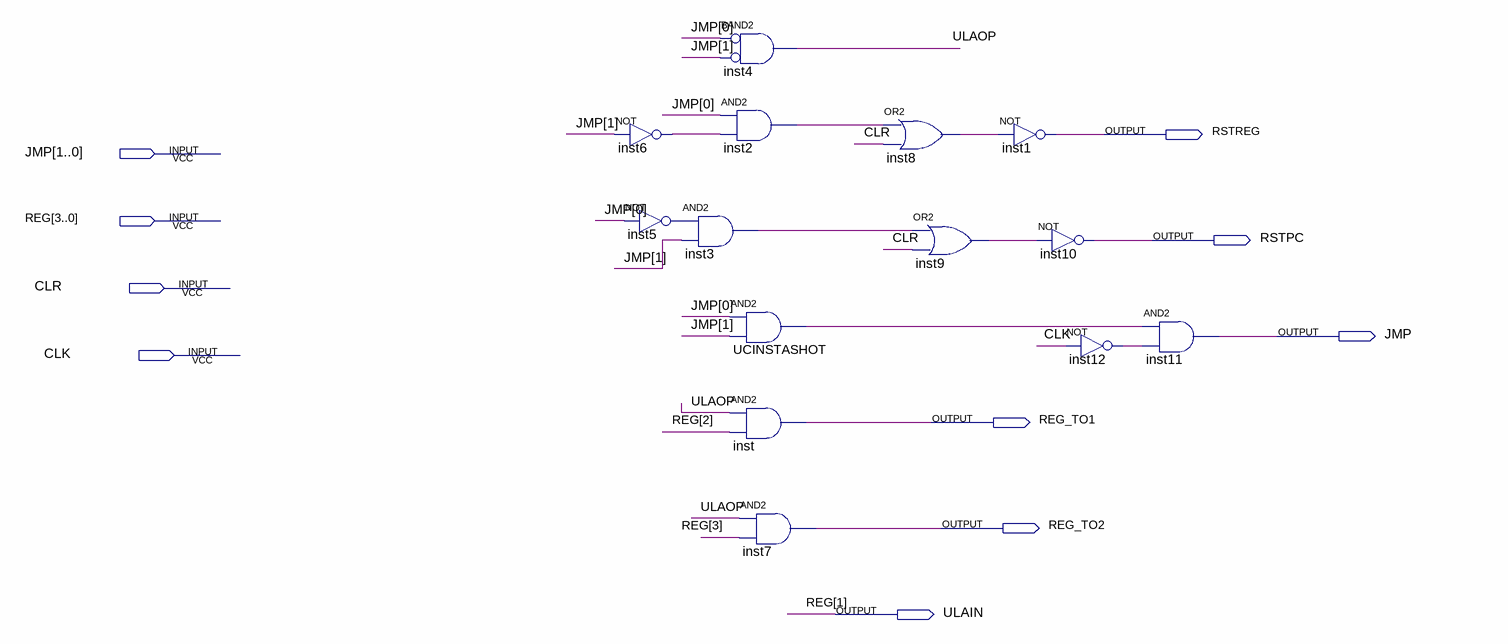
[diagram p0: schematic sheet]
// Quartus schematic UC.bdf as structural Verilog: 14 symbols, 10 pins
module UC (
  input  [1:0] JMP,
  input  [3:0] REG,
  input  CLR,
  input  CLK,
  output RSTREG,
  output RSTPC,
  output JMP_1bit,
  output REG_TO1,
  output REG_TO2,
  output ULAIN
);

  wire inst2_out, inst3_out, inst5_out, inst6_out, inst8_out, inst9_out, inst12_out, UCINSTASHOT_out, ULAOP;

  not inst6 (inst6_out, JMP[1]);
  and inst3 (inst3_out, inst5_out, JMP[1]);
  not inst5 (inst5_out, JMP[0]);
  and inst4 (ULAOP, ~JMP[0], ~JMP[1]);  // BAND2
  and inst2 (inst2_out, JMP[0], inst6_out);
  and UCINSTASHOT (UCINSTASHOT_out, JMP[0], JMP[1]);
  and inst (REG_TO1, ULAOP, REG[2]);
  and inst7 (REG_TO2, ULAOP, REG[3]);
  or inst8 (inst8_out, inst2_out, CLR);
  or inst9 (inst9_out, inst3_out, CLR);
  not inst1 (RSTREG, inst8_out);
  not inst10 (RSTPC, inst9_out);
  not inst12 (inst12_out, CLK);
  and inst11 (JMP_1bit, UCINSTASHOT_out, inst12_out);

  assign ULAIN = REG[1];
endmodule
